# EAGLE design interstage_B1 (EAGLE 9.6.1)
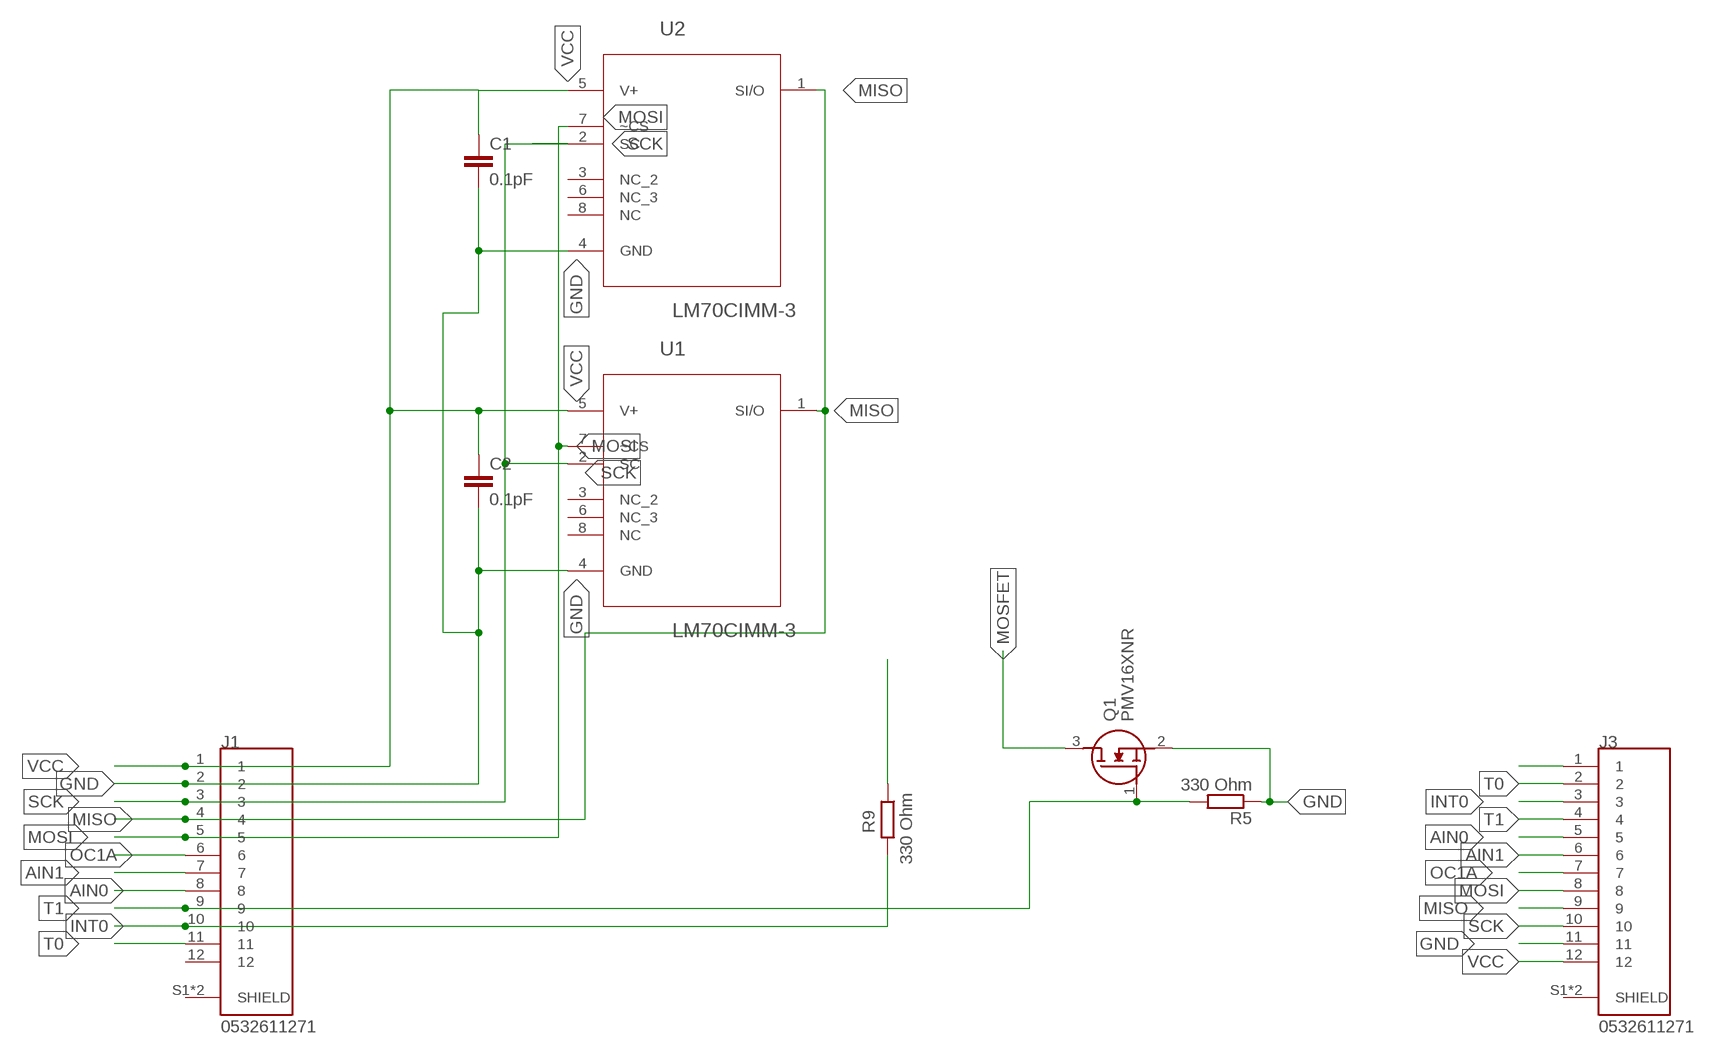
[diagram p0: schematic, sheet 1]

## Parts
C1  0.1pF  C-EUC0603K  [C0603K]
C2  0.1pF  C-EUC0603K  [C0603K]
J1  0532611271  [MOLEX_0532611271]
J3  0532611271  [MOLEX_0532611271]
Q1  PMV16XNR  [SOT95P230X110-3N]
R5  330 Ohm  R-EU_R1206  [R1206]
R9  330 Ohm  R-EU_R1206  [R1206]
U1  LM70CIMM-3  [SOP65P490X110-8N]
U2  LM70CIMM-3  [SOP65P490X110-8N]

## Nets
AIN0: J1.8 J3.5
AIN1: J1.7 J3.6
GND: C1.2 C2.2 J1.2 J3.11 Q1.2(S) R5.1 U1.4(GND) U2.4(GND)
INT0: J1.10 J3.3 R9.2
MISO: J1.4 J3.9 U1.1(SI/O) U2.1(SI/O)
MOSFET: Q1.3(D)
MOSI: J1.5 J3.8 U1.7(~CS) U2.7(~CS)
N$3: J3.1
N$4: R9.1
OC1A: J1.6 J3.7
SCK: J1.3 J3.10 U1.2(SC) U2.2(SC)
T0: J1.11 J3.2
T1: J1.9 J3.4 Q1.1(G) R5.2
VCC: C1.1 C2.1 J1.1 J3.12 U1.5(V+) U2.5(V+)
Unconnected: J1.12 J1.S1(SHIELD) J1.S2(SHIELD) J3.S1(SHIELD) J3.S2(SHIELD) U1.3(NC_2) U1.6(NC_3) U1.8(NC) U2.3(NC_2) U2.6(NC_3) U2.8(NC)

## Library data of the parts
C1 C2 = rcl:C-EU: CAPACITOR, European symbol; SPICEPREFIX: C
J1 J3 = picoblade:0532611271: Conn Shrouded Header HDR 12 POS 1.25mm Solder RA SMD PicoBlade; AVAILABILITY: Unavailable; DESCRIPTION: Picoblade Connector, 12 Circuit Single Row, Right Angle Surface Mount SMT PCB; MF: Molex; MP: 0532611271; PACKAGE: None; PRICE: None
Q1 = SamacSys_Parts:PMV16XNR: Nexperia PMV16XNR N-channel MOSFET, 8.6 A, 20 V PMV16XN, 3-Pin SOT-23 Source: Datasheet <https://componentsearchengine.com/Datasheets/1/PMV16XNR.pdf>; DESCRIPTION: Nexperia PMV16XNR N-channel MOSFET, 8.6 A, 20 V PMV16XN, 3-Pin SOT-23; HEIGHT: 1.1mm; MANUFACTURER_NAME: Nexperia; MANUFACTURER_PART_NUMBER: PMV16XNR; MOUSER_PART_NUMBER: 771-PMV16XNR; MOUSER_PRICE-STOCK: https://www.mouser.com/Search/Refine.aspx?Keyword=771-PMV16XNR
R5 R9 = rcl:R-EU_: RESISTOR, European symbol; SPICEPREFIX: R
U1 U2 = LM70CIMM-3:LM70CIMM-3: 10-Bit plus Sign Digital Temperature Sensor; AVAILABILITY: Unavailable; DESCRIPTION: Temperature Sensor Digital, Local -55°C ~ 150°C 10 b 8-VSSOP; MF: Texas Instruments; MP: LM70CIMM-3/NOPB; PACKAGE: MSOP-8 Texas Instruments; PRICE: None

## Board
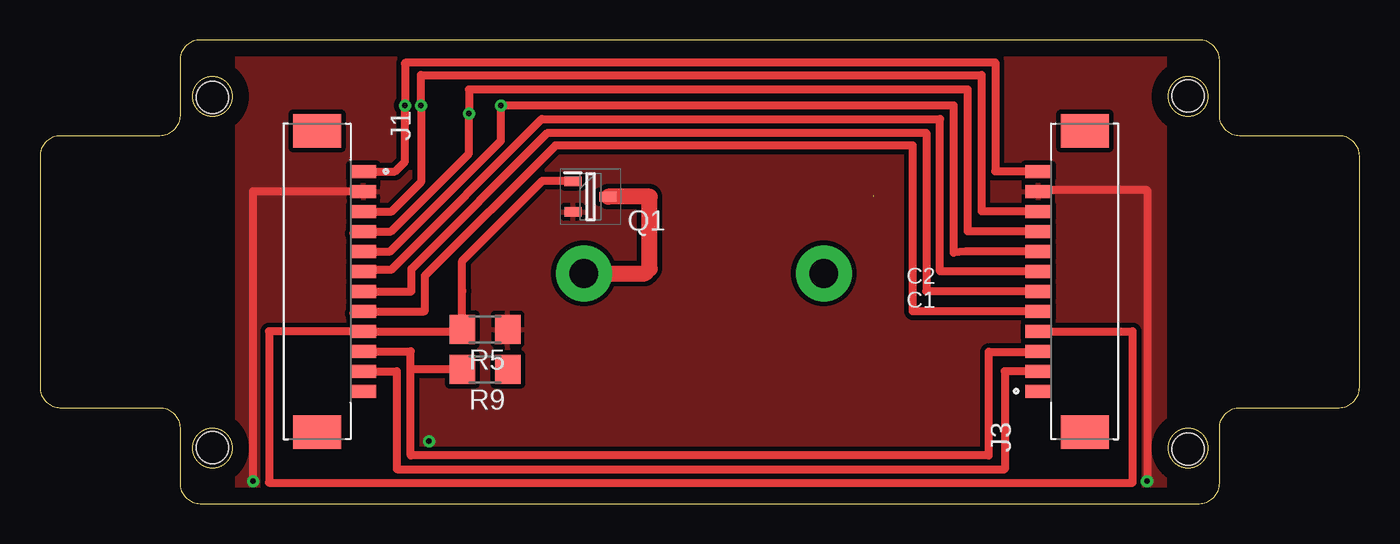
[diagram p1: board, top side]
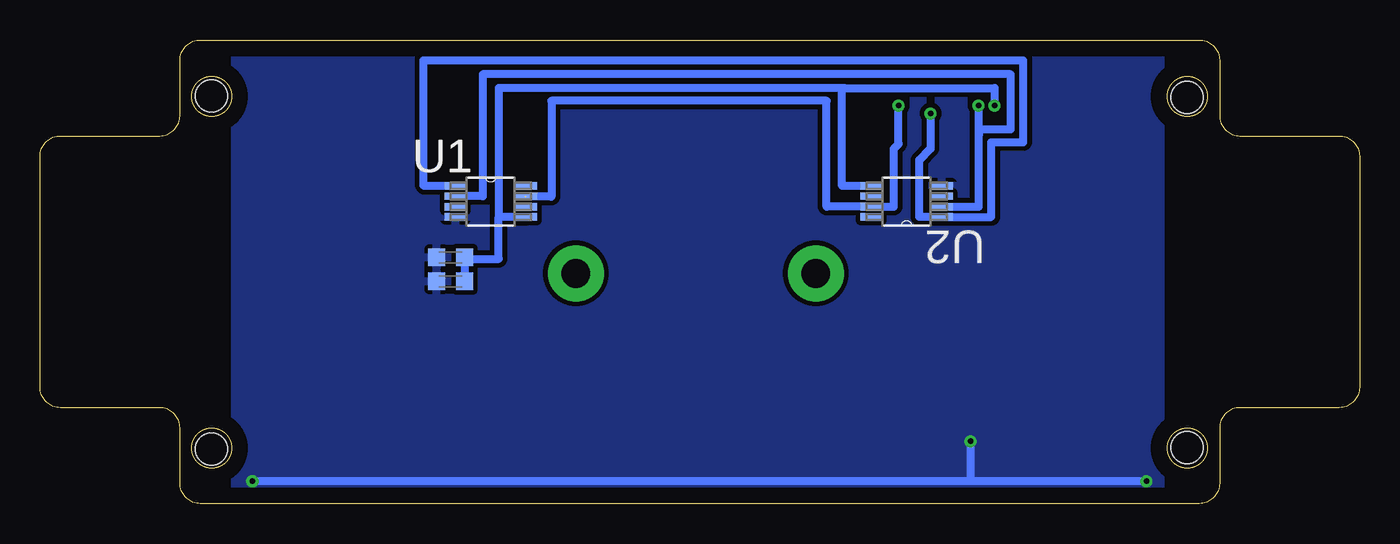
[diagram p2: board, bottom side, seen from below]

Size 82.5 x 29 mm. Coordinates in mm from the lower left corner, seen from the top.
Outline: 0,7.27 arc90 1.27,6 7.48,6 arc-90 8.75,4.73 8.75,1.27 arc90 10.02,0 72.48,0 arc90 73.75,1.27 73.75,4.73 arc-90 75.02,6 81.23,6 arc90 82.5,7.27 82.5,21.73 arc90 81.23,23 75.02,23 arc-90 73.75,24.27 73.75,27.73 arc90 72.48,29 10.02,29 arc90 8.75,27.73 8.75,24.27 arc-90 7.48,23 1.27,23 arc90 0,21.73 0,7.27
Outline: circle at 71.78,25.47 radius 1.25
Outline: circle at 10.78,3.48 radius 1.25
Outline: circle at 10.78,25.47 radius 1.25
Outline: circle at 71.78,3.48 radius 1.25
Copper layers (1*16): Top 0.035mm / dielectric 1.5mm / Bottom 0.035mm
Design rules "default *": minimum track width 6mil, minimum drill 0.35mm, track to track 0.3mm, track to pad 6mil, pad to pad 6mil, via to via 6mil, smd to smd 6mil, copper to edge 40mil, drill to drill 6mil, minimum pad ring 10mil, minimum via ring 8mil, stop-mask expansion 4mil, vias tented up to drill 0mil, thermal gap 10mil
Holes 2 mm at 10.77,3.5 10.77,25.4 71.77,3.4 71.77,25.5

### Footprints (pad centres in the part's own frame; a part is rotated, then mirrored left to right if it is on the bottom)
C0603K = smd 1.05 x 1.08: 1 -0.875,0; 2 0.875,0
MOLEX_0532611271 = smd 0.8 x 1.6: 1 -6.875,2.9; 2 -5.625,2.9; 3 -4.375,2.9; 4 -3.125,2.9; 5 -1.875,2.9; 6 -0.625,2.9; 7 0.625,2.9; 8 1.875,2.9; 9 3.125,2.9; 10 4.375,2.9; 11 5.625,2.9; 12 6.875,2.9 | smd 2.1 x 3: S1 -9.425,0; S2 9.425,0
SOT95P230X110-3N = smd 1.05 x 0.6: 1 -1.1,0.95; 2 -1.1,-0.95; 3 1.1,0
R1206 = smd 1.6 x 1.803: 1 -1.422,0; 2 1.422,0
SOP65P490X110-8N = smd 1.372 x 0.457: 1 -2.21,0.965; 2 -2.21,0.33; 3 -2.21,-0.33; 4 -2.21,-0.965; 5 2.21,-0.965; 6 2.21,-0.33; 7 2.21,0.33; 8 2.21,0.965

### Placement (x,y rotation side)
C1  56.82,13.9 180 bottom
C2  56.82,15.4 180 bottom
J1  17.32,13.9 270 top
J3  65.32,13.9 90 top
Q1  34.42,19.2 0 top
R5  27.82,10.9 180 top
R9  27.82,8.4 180 top
U1  54.32,18.9 0 bottom
U2  28.32,18.9 180 bottom

### Tracks (layer width: path | path; a pad name or v marks a point on that pad's centre or on a via)
AIN0
  Top 0.5: 19.59,11.9 J1.8 24.02,12.03 24.08,12.08 24.08,14.26 32.22,22.4 54.57,22.4 54.57,12.03 J3.5
AIN1
  Top 0.5: J1.7 23.22,13.28 23.22,14.68 31.74,23.2 55.42,23.2 55.42,13.28 J3.6
GND  (via drill 0.35)
  Top 0.5: J1.2 13.32,19.52 v13.32,1.4 | 62.42,19.6 69.22,19.6 v69.22,1.4
  Bottom 0.5: v13.32,1.4 24.42,1.4 | 24.42,1.4 v69.22,1.4 | v24.32,3.9 24.32,1.5 24.42,1.4
  pour Top: 12.32,27.9 12.32,0.4 70.32,0.4 70.32,27.9
  pour Bottom: 12.42,27.9 70.32,27.9 70.32,0.4 12.42,0.4
INT0
  Top 0.5: 61.82,9.5 59.32,9.5 59.32,3 23.17,3 23.17,8.4 | 61.82,9.5 62.22,9.5 | J1.10 23.17,9.53 23.17,8.4 | 61.82,9.5 61.84,9.53 J3.3 | R9.2 23.17,8.4
MISO  (via drill 0.35)
  Top 0.5: 19.59,16.9 J1.4 21.95,17.02 26.82,21.9 v26.82,24.4 26.82,25.9 58.02,25.9 58.02,17.02 J3.9
  Bottom 0.5: v26.82,24.4 26.82,22.2 27.52,21.5 27.52,17.93 U2.1 23.02,17.93 23.02,22.6 21.02,22.6 21.02,27.7 58.52,27.7 58.52,19.92 58.46,19.86 U1.1
MOSFET  (via drill 1.8 pad 3.5)
  Top 1: v34,14.4 37.82,14.4 38.12,14.7 38.12,19.2 Q1.3
MOSI  (via drill 0.35)  (1 unrouted)
  Top 0.5: J3.8 57.9,15.78 57.12,15.69 57.12,24.9 v28.82,24.9 28.82,22.7 21.89,15.78 J1.5
  Bottom 0.5: v28.82,24.9 28.82,22.5 29.12,22.2 29.12,18.57 U2.7 33.32,18.57 33.32,25.2 50.52,25.2 50.52,19.19 52.15,19.19
N$2  (via drill 1.8 pad 3.5)
  other vias: 49,14.4
OC1A
  Top 0.5: 19.84,14.4 J1.6 20.32,14.62 21.95,14.62 31.37,24.05 56.27,24.05 56.27,14.53 J3.7
SCK  (via drill 0.35)
  Top 0.5: J1.3 22,18.27 23.82,20.1 v23.82,24.9 23.82,26.8 58.87,26.8 58.87,18.27 J3.10
  Bottom 0.5: U1.2 54.82,19.23 54.82,26.85 21.82,26.85 21.82,23.4 23.82,23.4 | v23.82,24.9 23.82,23.4 | 23.82,23.4 23.82,23.1 | 23.82,23.1 23.82,18.57 U2.2 | 23.79,23.1 23.82,23.1
T0
  Top 0.5: J1.11 22.32,8.28 22.32,2.15 60.32,2.15 60.32,8.28 J3.2
T1
  Top 0.5: J3.4 68.32,10.78 68.32,1.3 14.32,1.3 14.32,10.78 J1.9 26.27,10.78 R5.2 26.4,13.28 | 26.4,13.28 26.42,13.3 | 26.4,13.28 26.4,15.18 31.42,20.2 33.27,20.2 Q1.1
VCC  (via drill 0.35)
  Top 0.5: J1.1 22.2,20.77 22.82,21.4 v22.82,24.9 22.82,27.53 22.89,27.6 59.72,27.6 59.72,20.79 59.74,20.77 J3.12
  Bottom 0.5: v22.82,24.9 22.82,26 32.22,26 | 32.22,26 53.82,26 53.82,17.93 | U1.5 53.82,17.93 | C1.1 C2.1 55.84,15.3 53.82,15.3 53.82,17.93 | U2.5 32.35,19.86 32.35,25.87 32.22,26